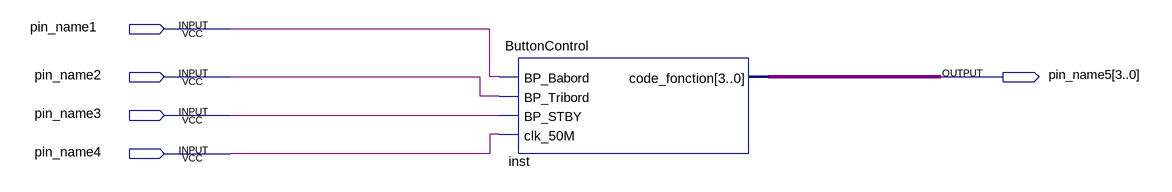
[diagram p0: schematic sheet]
// Quartus schematic block1.bdf as structural Verilog: 1 symbols, 5 pins
module block1 (
  input  pin_name1,
  input  pin_name2,
  input  pin_name3,
  input  pin_name4,
  output [3:0] pin_name5
);

  ButtonControl inst (
    .BP_Babord(pin_name1), .BP_Tribord(pin_name2), .BP_STBY(pin_name3), .clk_50M(pin_name4),
    .code_fonction(pin_name5));
endmodule
